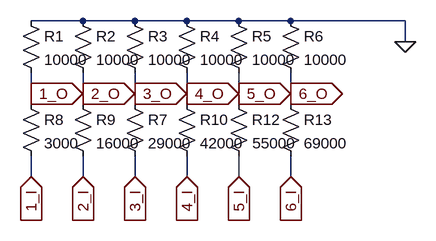
[diagram p0: schematic jstcon.asc]
jstcon.asc, the LTspice schematic file:
Version 4
SHEET 1 880 680
WIRE 32 -16 -48 -16
WIRE 112 -16 32 -16
WIRE 192 -16 112 -16
WIRE 272 -16 192 -16
WIRE 352 -16 272 -16
WIRE 528 -16 352 -16
WIRE 528 16 528 -16
WIRE -48 96 -48 64
WIRE 32 96 32 64
WIRE 112 96 112 64
WIRE 192 96 192 64
WIRE 272 96 272 64
WIRE 352 96 352 64
WIRE -48 112 -48 96
WIRE 32 112 32 96
WIRE 112 112 112 96
WIRE 192 112 192 96
WIRE 272 112 272 96
WIRE 352 112 352 96
WIRE -48 224 -48 192
WIRE 32 224 32 192
WIRE 112 224 112 192
WIRE 192 224 192 192
WIRE 272 224 272 192
WIRE 352 224 352 192
FLAG 528 16 0
FLAG -48 96 1_O
IOPIN -48 96 Out
FLAG 32 96 2_O
IOPIN 32 96 Out
FLAG 112 96 3_O
IOPIN 112 96 Out
FLAG 192 96 4_O
IOPIN 192 96 Out
FLAG 272 96 5_O
IOPIN 272 96 Out
FLAG 352 96 6_O
IOPIN 352 96 Out
FLAG -48 224 1_I
IOPIN -48 224 In
FLAG 32 224 2_I
IOPIN 32 224 In
FLAG 112 224 3_I
IOPIN 112 224 In
FLAG 192 224 4_I
IOPIN 192 224 In
FLAG 272 224 5_I
IOPIN 272 224 In
FLAG 352 224 6_I
IOPIN 352 224 In
SYMBOL res -64 -32 R0
SYMATTR InstName R1
SYMATTR Value 10000
SYMBOL res 16 -32 R0
SYMATTR InstName R2
SYMATTR Value 10000
SYMBOL res 96 -32 R0
SYMATTR InstName R3
SYMATTR Value 10000
SYMBOL res 176 -32 R0
SYMATTR InstName R4
SYMATTR Value 10000
SYMBOL res 256 -32 R0
SYMATTR InstName R5
SYMATTR Value 10000
SYMBOL res 336 -32 R0
SYMATTR InstName R6
SYMATTR Value 10000
SYMBOL res -64 96 R0
SYMATTR InstName R8
SYMATTR Value 3000
SYMBOL res 16 96 R0
SYMATTR InstName R9
SYMATTR Value 16000
SYMBOL res 256 96 R0
WINDOW 3 37 76 Left 2
SYMATTR Value 55000
SYMATTR InstName R12
SYMBOL res 336 96 R0
SYMATTR InstName R13
SYMATTR Value 69000
SYMBOL res 96 96 R0
SYMATTR InstName R7
SYMATTR Value 29000
SYMBOL res 176 96 R0
SYMATTR InstName R10
SYMATTR Value 42000

The netlist it stands for:
* jstcon.asc
R1 0 1_O 10000
R2 0 2_O 10000
R3 0 3_O 10000
R4 0 4_O 10000
R5 0 5_O 10000
R6 0 6_O 10000
R8 1_O 1_I 3000
R9 2_O 2_I 16000
R12 5_O 5_I 55000
R13 6_O 6_I 69000
R7 3_O 3_I 29000
R10 4_O 4_I 42000
.backanno
.end